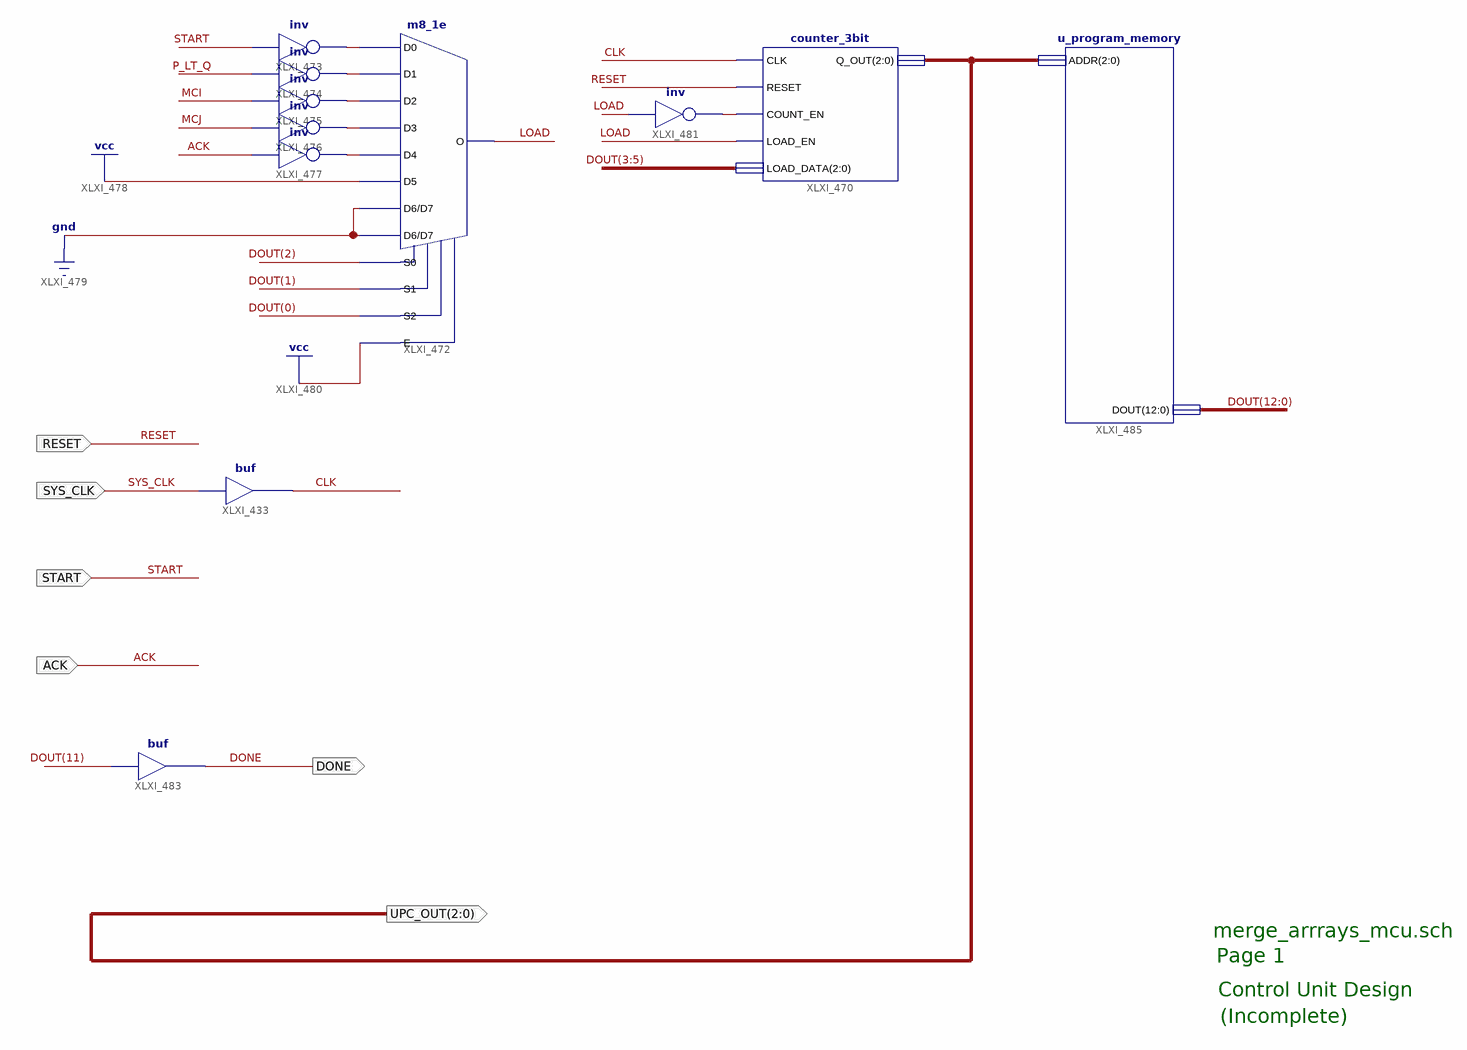
[diagram p0: schematic sheet 1]
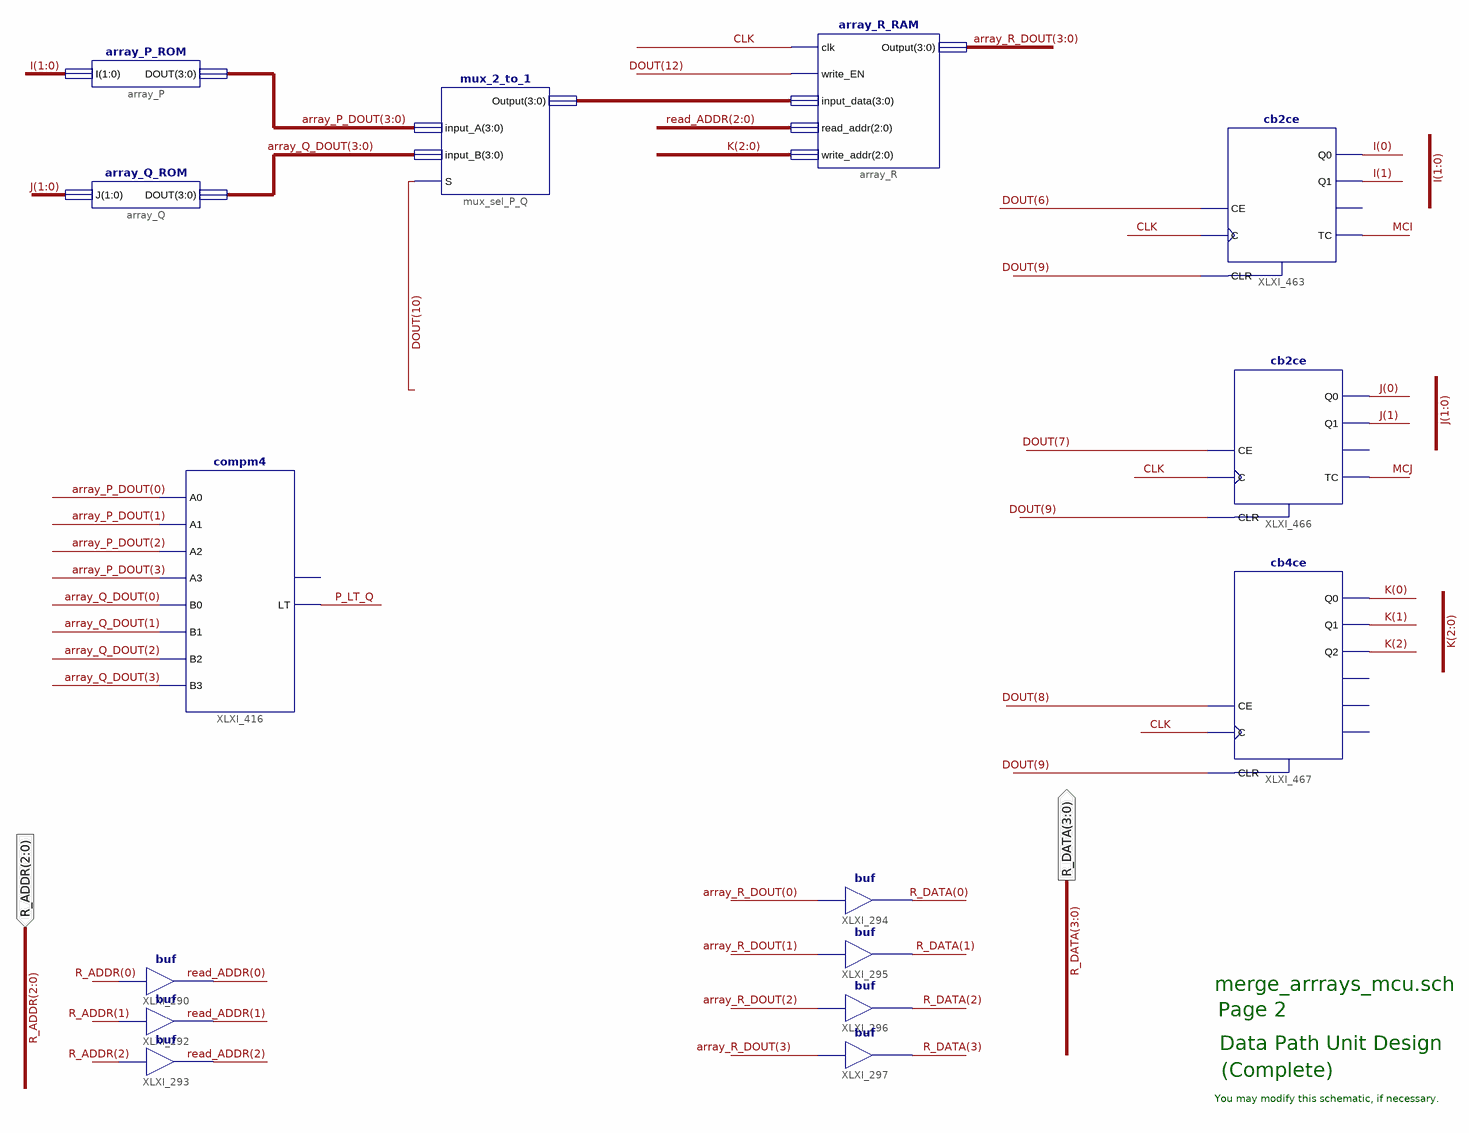
[diagram p1: schematic sheet 2]
// Xilinx ISE schematic merge_arrays_mcu.sch (spartan6) as structural Verilog: 26 symbols, 8 ports
module merge_arrays_mcu (
  input  ACK,
  input  RESET,
  input  SYS_CLK,
  input  START,
  input  [2:0] R_ADDR,
  output [3:0] R_DATA,
  output DONE,
  output [2:0] UPC_OUT
);

  wire CLK, LOAD, MCI, MCJ, P_LT_Q, XLXN_805, XLXN_806, XLXN_807, XLXN_808, XLXN_809, XLXN_848;
  wire [1:0] I, J;
  wire [2:0] K, read_ADDR;
  wire [3:0] array_P_DOUT, array_Q_DOUT, array_R_DOUT, XLXN_149;
  wire [12:0] DOUT;

  array_P_ROM array_P (.I(I), .DOUT(array_P_DOUT));
  array_Q_ROM array_Q (.J(J), .DOUT(array_Q_DOUT));
  mux_2_to_1 mux_sel_P_Q (.input_A(array_P_DOUT), .input_B(array_Q_DOUT), .Output(XLXN_149), .S(DOUT[10]));
  array_R_RAM array_R (
    .clk(CLK), .write_EN(DOUT[12]), .input_data(XLXN_149), .read_addr(read_ADDR), .write_addr(K),
    .Output(array_R_DOUT));
  buf XLXI_294 (R_DATA[0], array_R_DOUT[0]);
  buf XLXI_295 (R_DATA[1], array_R_DOUT[1]);
  buf XLXI_296 (R_DATA[2], array_R_DOUT[2]);
  buf XLXI_297 (R_DATA[3], array_R_DOUT[3]);
  compm4 XLXI_416 (
    .A0(array_P_DOUT[0]), .A1(array_P_DOUT[1]), .A2(array_P_DOUT[2]), .A3(array_P_DOUT[3]),
    .B0(array_Q_DOUT[0]), .B1(array_Q_DOUT[1]), .B2(array_Q_DOUT[2]), .B3(array_Q_DOUT[3]), .LT(P_LT_Q));  // open: GT
  buf XLXI_290 (read_ADDR[0], R_ADDR[0]);
  buf XLXI_292 (read_ADDR[1], R_ADDR[1]);
  buf XLXI_293 (read_ADDR[2], R_ADDR[2]);
  buf XLXI_433 (CLK, SYS_CLK);
  cb2ce XLXI_463 (.C(CLK), .CE(DOUT[6]), .CLR(DOUT[9]), .Q0(I[0]), .Q1(I[1]), .TC(MCI));  // open: CEO
  cb2ce XLXI_466 (.C(CLK), .CE(DOUT[7]), .CLR(DOUT[9]), .Q0(J[0]), .Q1(J[1]), .TC(MCJ));  // open: CEO
  cb4ce XLXI_467 (.C(CLK), .CE(DOUT[8]), .CLR(DOUT[9]), .Q0(K[0]), .Q1(K[1]), .Q2(K[2]));  // open: CEO, Q3, TC
  counter_3bit XLXI_470 (
    .CLK(CLK), .RESET(RESET), .COUNT_EN(XLXN_848), .LOAD_EN(LOAD), .LOAD_DATA({DOUT[3], DOUT[4], DOUT[5]}),
    .Q_OUT(UPC_OUT));
  m8_1e XLXI_472 (
    .D0(XLXN_805), .D1(XLXN_806), .D2(XLXN_807), .D3(XLXN_808), .D4(XLXN_809), .D5(1'b1), .D6(1'b0),
    .D7(1'b0), .E(1'b1), .S0(DOUT[2]), .S1(DOUT[1]), .S2(DOUT[0]), .O(LOAD));
  not XLXI_473 (XLXN_805, START);
  not XLXI_474 (XLXN_806, P_LT_Q);
  not XLXI_475 (XLXN_807, MCI);
  not XLXI_476 (XLXN_808, MCJ);
  not XLXI_477 (XLXN_809, ACK);
  not XLXI_481 (XLXN_848, LOAD);
  buf XLXI_483 (DONE, DOUT[11]);
  u_program_memory XLXI_485 (.ADDR(UPC_OUT), .DOUT(DOUT));

  // Notes on the sheet:
  //   merge_arrrays_mcu.sch
  //   Page 1
  //   Control Unit Design
  //   (Incomplete)
  //   merge_arrrays_mcu.sch
  //   Page 2
  //   Data Path Unit Design
  //   (Complete)
  //   You may modify this schematic, if necessary.
endmodule
